# EAGLE design Audioaktor (EAGLE 5.02)
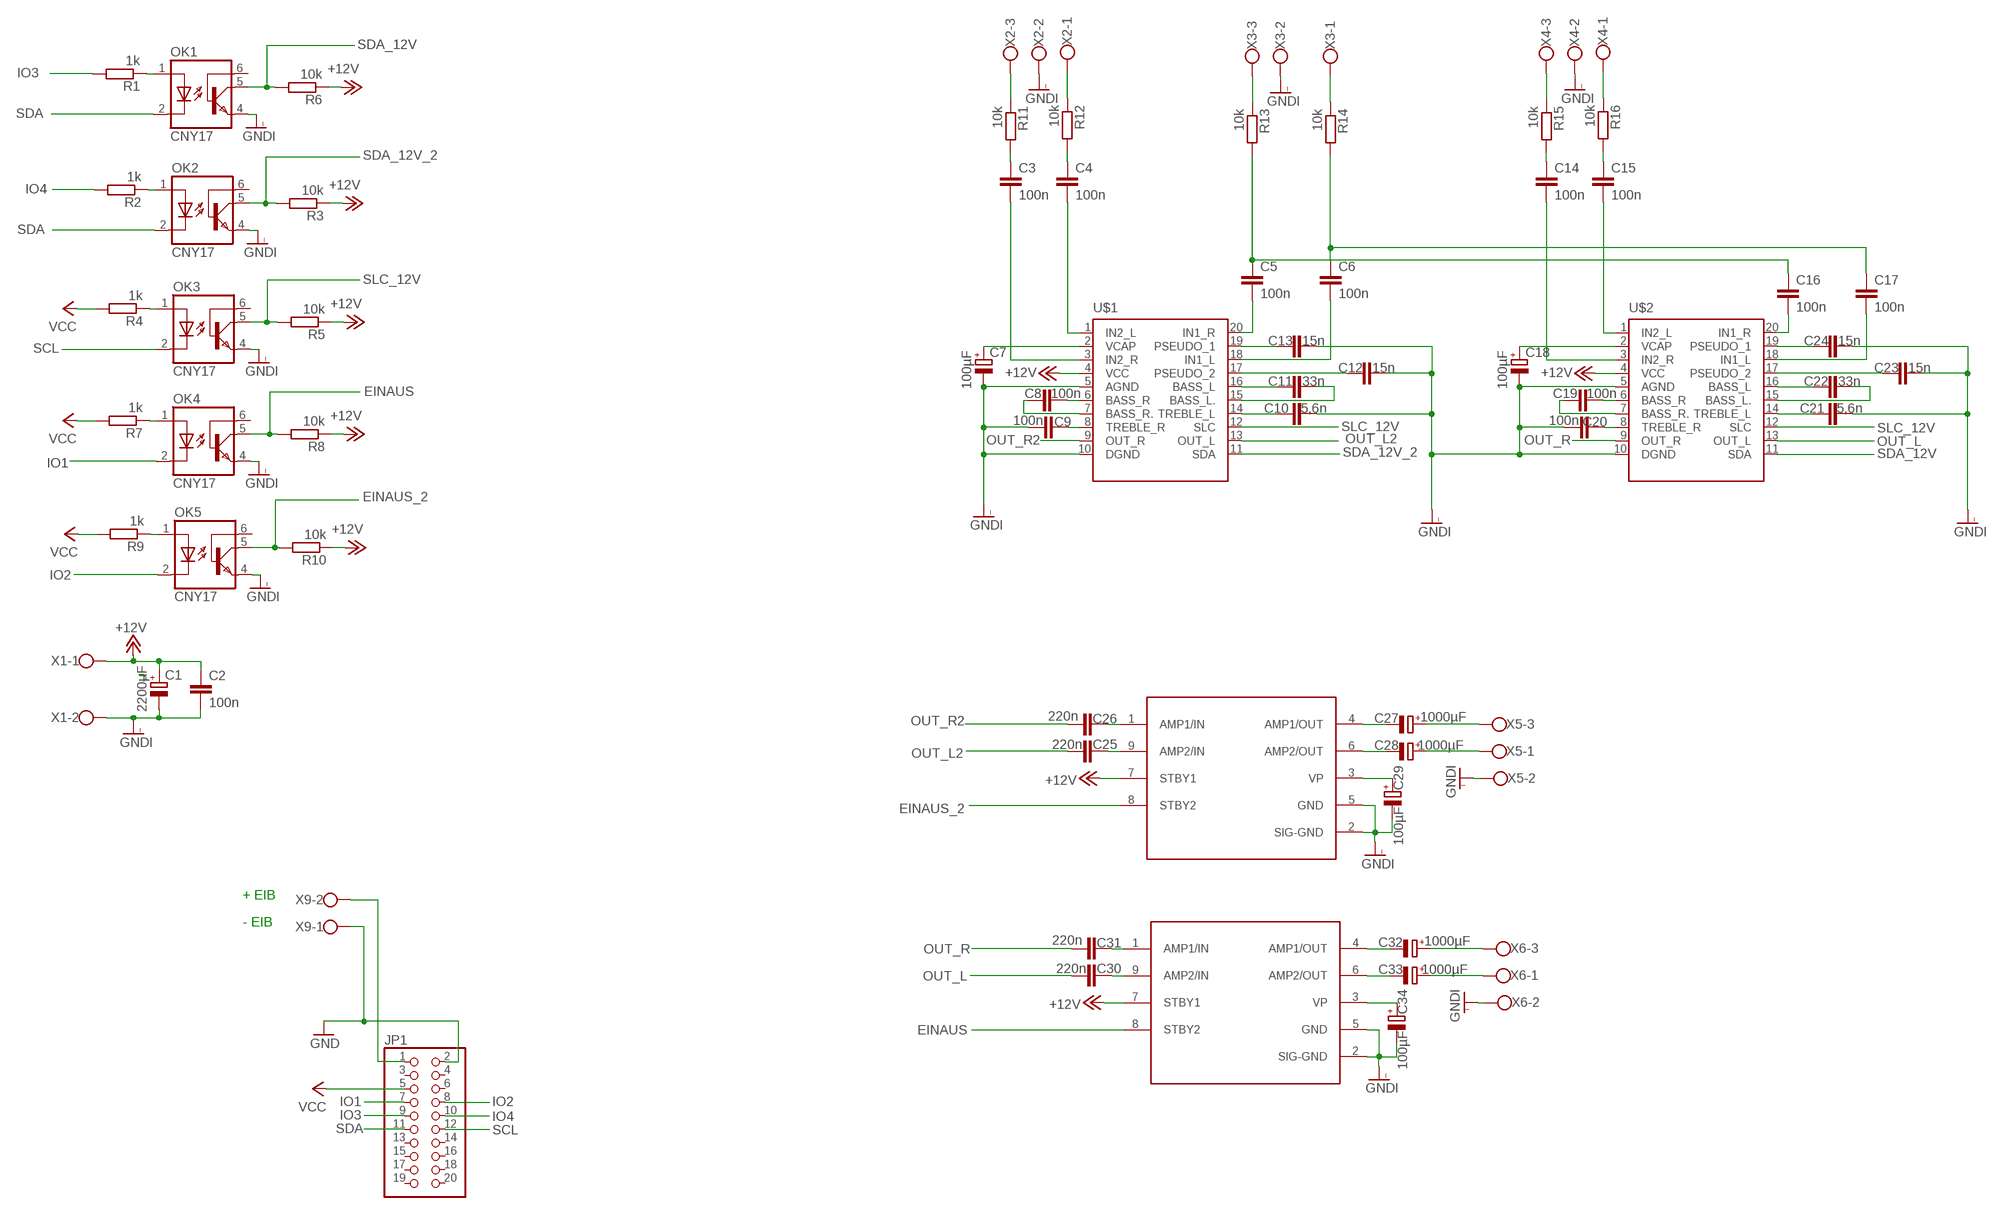
[diagram p0: schematic, sheet 1]

## Parts
C1  2200µF  CPOL-EUE5-10.5  [E5-10,5]
C2  100n  C-EU050-030X075  [C050-030X075]
C3  100n  C-EU050-030X075  [C050-030X075]
C4  100n  C-EU050-030X075  [C050-030X075]
C5  100n  C-EU050-030X075  [C050-030X075]
C6  100n  C-EU050-030X075  [C050-030X075]
C7  100µF  CPOL-EUE5-10.5  [E5-10,5]
C8  100n  C-EU050-030X075  [C050-030X075]
C9  100n  C-EU050-030X075  [C050-030X075]
C10  5,6n  C-EU050-030X075  [C050-030X075]
C11  33n  C-EU050-030X075  [C050-030X075]
C12  15n  C-EU050-030X075  [C050-030X075]
C13  15n  C-EU050-030X075  [C050-030X075]
C14  100n  C-EU050-030X075  [C050-030X075]
C15  100n  C-EU050-030X075  [C050-030X075]
C16  100n  C-EU050-030X075  [C050-030X075]
C17  100n  C-EU050-030X075  [C050-030X075]
C18  100µF  CPOL-EUE5-10.5  [E5-10,5]
C19  100n  C-EU050-030X075  [C050-030X075]
C20  100n  C-EU050-030X075  [C050-030X075]
C21  5,6n  C-EU050-030X075  [C050-030X075]
C22  33n  C-EU050-030X075  [C050-030X075]
C23  15n  C-EU050-030X075  [C050-030X075]
C24  15n  C-EU050-030X075  [C050-030X075]
C25  220n  C-EU050-030X075  [C050-030X075]
C26  220n  C-EU050-030X075  [C050-030X075]
C27  1000µF  CPOL-EUE5-10.5  [E5-10,5]
C28  1000µF  CPOL-EUE5-10.5  [E5-10,5]
C29  100µF  CPOL-EUE5-10.5  [E5-10,5]
C30  220n  C-EU050-030X075  [C050-030X075]
C31  220n  C-EU050-030X075  [C050-030X075]
C32  1000µF  CPOL-EUE5-10.5  [E5-10,5]
C33  1000µF  CPOL-EUE5-10.5  [E5-10,5]
C34  100µF  CPOL-EUE5-10.5  [E5-10,5]
JP1  PINHD-2X10  [2X10]
OK1  CNY17  [DIL06]
OK2  CNY17  [DIL06]
OK3  CNY17  [DIL06]
OK4  CNY17  [DIL06]
OK5  CNY17  [DIL06]
R1  1k  R-EU_0204/7  [0204/7]
R2  1k  R-EU_0204/7  [0204/7]
R3  10k  R-EU_0204/7  [0204/7]
R4  1k  R-EU_0204/7  [0204/7]
R5  10k  R-EU_0204/7  [0204/7]
R6  10k  R-EU_0204/7  [0204/7]
R7  1k  R-EU_0204/7  [0204/7]
R8  10k  R-EU_0204/7  [0204/7]
R9  1k  R-EU_0204/7  [0204/7]
R10  10k  R-EU_0204/7  [0204/7]
R11  10k  R-EU_0204/7  [0204/7]
R12  10k  R-EU_0204/7  [0204/7]
R13  10k  R-EU_0204/7  [0204/7]
R14  10k  R-EU_0204/7  [0204/7]
R15  10k  R-EU_0204/7  [0204/7]
R16  10k  R-EU_0204/7  [0204/7]
U$1  TDA8425  [DIL20]
U$2  TDA8425  [DIL20]
U$3  TDA1517  [TDA1517]
U$4  TDA1517  [TDA1517]
X1  W237-102  [W237-102]
X2  W237-103  [W237-103]
X3  W237-103  [W237-103]
X4  W237-103  [W237-103]
X5  W237-103  [W237-103]
X6  W237-103  [W237-103]
X9  W237-102  [W237-102]

## Nets
+12V: C1.+ C2.1 R3.1 R5.1 R6.1 R8.1 R10.1 U$1.4(VCC) U$2.4(VCC) U$3.7(STBY1) U$4.7(STBY1) X1.1
EINAUS: OK4.5(COL) R8.2 U$4.8(STBY2)
EINAUS_2: OK5.5(COL) R10.2 U$3.8(STBY2)
GND: JP1.2 X9.1
GNDI: C1.- C2.2 C7.- C9.1 C10.2 C12.2 C13.2 C18.- C20.1 C21.2 C23.2 C24.2 C29.- C34.- OK1.4(EMI) OK2.4(EMI) OK3.4(EMI) OK4.4(EMI) OK5.4(EMI) U$1.5(AGND) U$1.10(DGND) U$2.5(AGND) U$2.10(DGND) U$3.2(SIG-GND) U$3.5(GND) U$4.2(SIG-GND) U$4.5(GND) X1.2 X2.2 X3.2 X4.2 X5.2 X6.2
IO1: JP1.7 OK4.2(C)
IO2: JP1.8 OK5.2(C)
IO3: JP1.9 R1.2
IO4: JP1.10 R2.2
N$1: OK1.1(A) R1.1
N$2: OK2.1(A) R2.1
N$3: OK3.1(A) R4.1
N$4: OK4.1(A) R7.1
N$5: OK5.1(A) R9.1
N$6: R11.1 X2.3
N$7: R12.1 X2.1
N$8: C3.1 R11.2
N$9: C4.1 R12.2
N$10: R13.1 X3.3
N$11: R14.1 X3.1
N$12: C5.1 C16.1 R13.2
N$13: C6.1 C17.1 R14.2
N$14: C3.2 U$1.3(IN2_R)
N$15: C4.2 U$1.1(IN2_L)
N$17: C7.+ U$1.2(VCAP)
N$18: C8.2 U$1.6(BASS_R)
N$19: C8.1 U$1.7(BASS_R.)
N$20: JP1.1 X9.2
N$21: C9.2 U$1.8(TREBLE_R)
N$22: C10.1 U$1.14(TREBLE_L)
N$23: C11.1 U$1.16(BASS_L)
N$24: C11.2 U$1.15(BASS_L.)
N$25: C13.1 U$1.19(PSEUDO_1)
N$27: C12.1 U$1.17(PSEUDO_2)
N$28: C5.2 U$1.20(IN1_R)
N$29: C6.2 U$1.18(IN1_L)
N$30: R15.1 X4.3
N$31: R16.1 X4.1
N$32: C14.1 R15.2
N$33: C15.1 R16.2
N$34: C26.2 U$3.1(AMP1/IN)
N$36: C25.2 U$3.9(AMP2/IN)
N$37: C27.- U$3.4(AMP1/OUT)
N$38: C28.- U$3.6(AMP2/OUT)
N$39: C14.2 U$2.3(IN2_R)
N$40: C15.2 U$2.1(IN2_L)
N$41: C18.+ U$2.2(VCAP)
N$42: C19.2 U$2.6(BASS_R)
N$43: C19.1 U$2.7(BASS_R.)
N$44: C20.2 U$2.8(TREBLE_R)
N$45: C21.1 U$2.14(TREBLE_L)
N$46: C22.1 U$2.16(BASS_L)
N$47: C22.2 U$2.15(BASS_L.)
N$48: C23.1 U$2.17(PSEUDO_2)
N$49: C24.1 U$2.19(PSEUDO_1)
N$50: C16.2 U$2.20(IN1_R)
N$51: C17.2 U$2.18(IN1_L)
N$52: C29.+ U$3.3(VP)
N$53: C31.2 U$4.1(AMP1/IN)
N$54: C27.+ X5.3
N$55: C28.+ X5.1
N$56: C30.2 U$4.9(AMP2/IN)
N$57: C32.- U$4.4(AMP1/OUT)
N$58: C33.- U$4.6(AMP2/OUT)
N$59: C34.+ U$4.3(VP)
N$60: C32.+ X6.3
N$61: C33.+ X6.1
OUT_L: C30.1 U$2.13(OUT_L)
OUT_L2: C25.1 U$1.13(OUT_L)
OUT_R: C31.1 U$2.9(OUT_R)
OUT_R2: C26.1 U$1.9(OUT_R)
SCL: JP1.12 OK3.2(C)
SDA: JP1.11 OK1.2(C) OK2.2(C)
SDA_12V: OK1.5(COL) R6.2 U$2.11(SDA)
SDA_12V_2: OK2.5(COL) R3.2 U$1.11(SDA)
SLC_12V: OK3.5(COL) R5.2 U$1.12(SLC) U$2.12(SLC)
VCC: JP1.5 R4.2 R7.2 R9.2
Unconnected: JP1.3 JP1.4 JP1.6 JP1.13 JP1.14 JP1.15 JP1.16 JP1.17 JP1.18 JP1.19 JP1.20 OK1.6(BAS) OK2.6(BAS) OK3.6(BAS) OK4.6(BAS) OK5.6(BAS)

## Notes on the sheet
- + EIB
- - EIB

## Library data of the parts
C1 C7 C18 C27-C29 C32-C34 = rcl:CPOL-EU: POLARIZED CAPACITOR, European symbol
C2-C6 C8-C17 C19-C26 C30 C31 = rcl:C-EU: CAPACITOR, European symbol
JP1 = pinhead:PINHD-2X10: PIN HEADER
OK1-OK5 = optocoupler:CNY17: SIEMENS OPTO COUPLER
R1-R16 = rcl:R-EU_: RESISTOR, European symbol
U$1 U$2 = TDA:TDA8425
U$3 U$4 = TDA:TDA1517
X1 X9 = con-wago-500:W237-102: WAGO SCREW CLAMP
X2-X6 = con-wago-500:W237-103: WAGO SCREW CLAMP

## Board
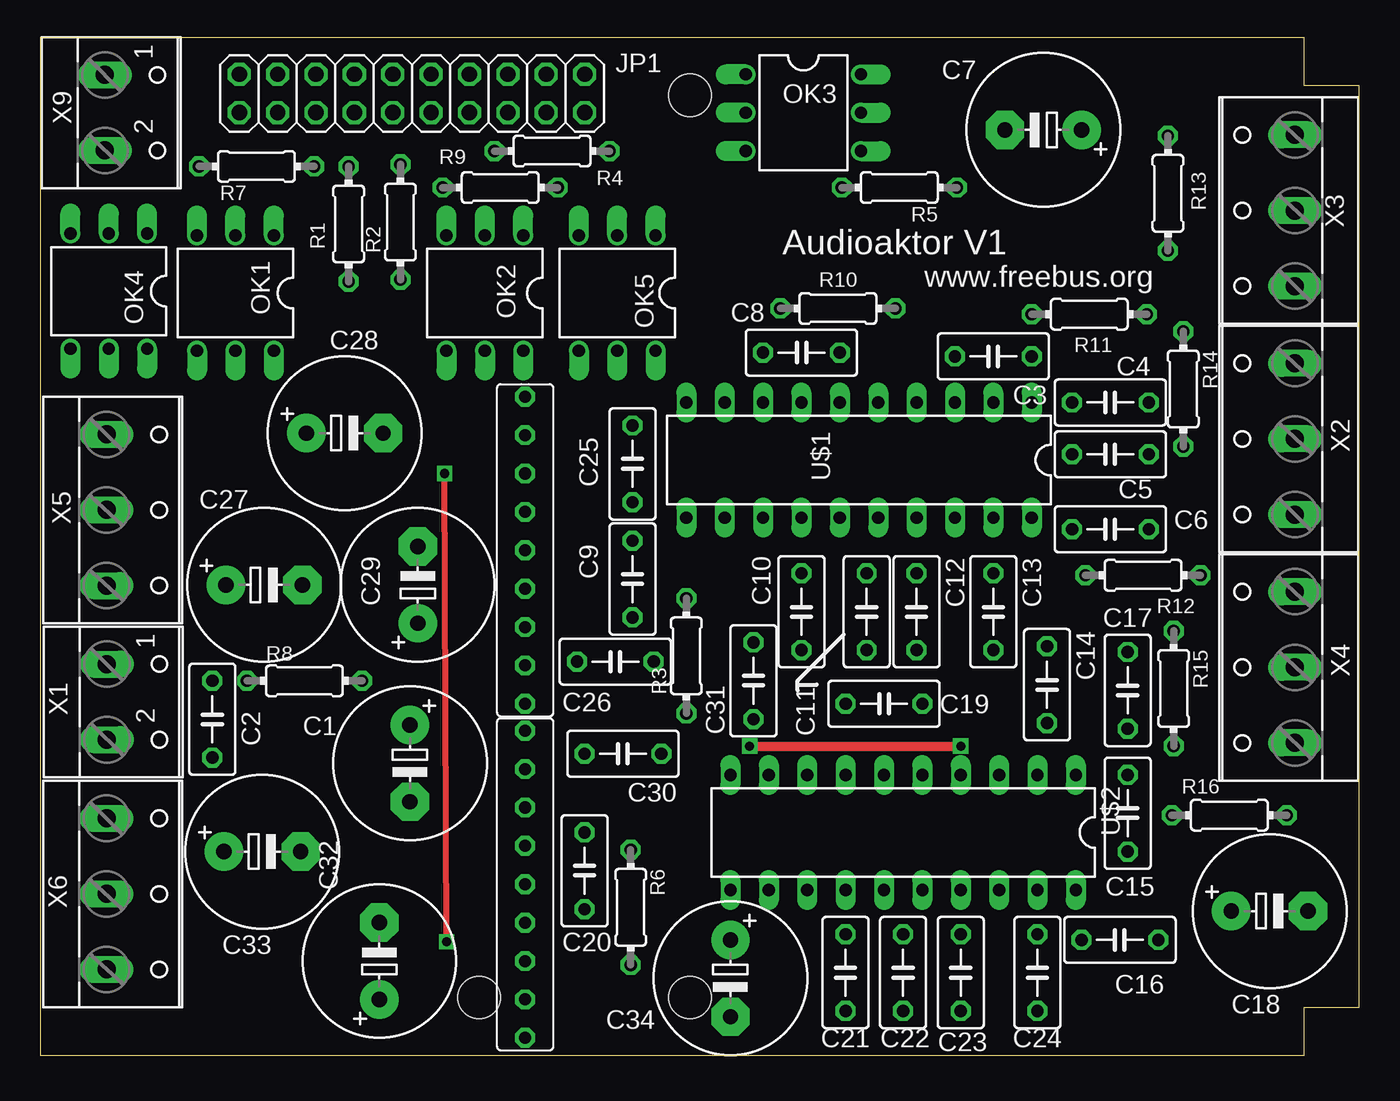
[diagram p1: board, top side]
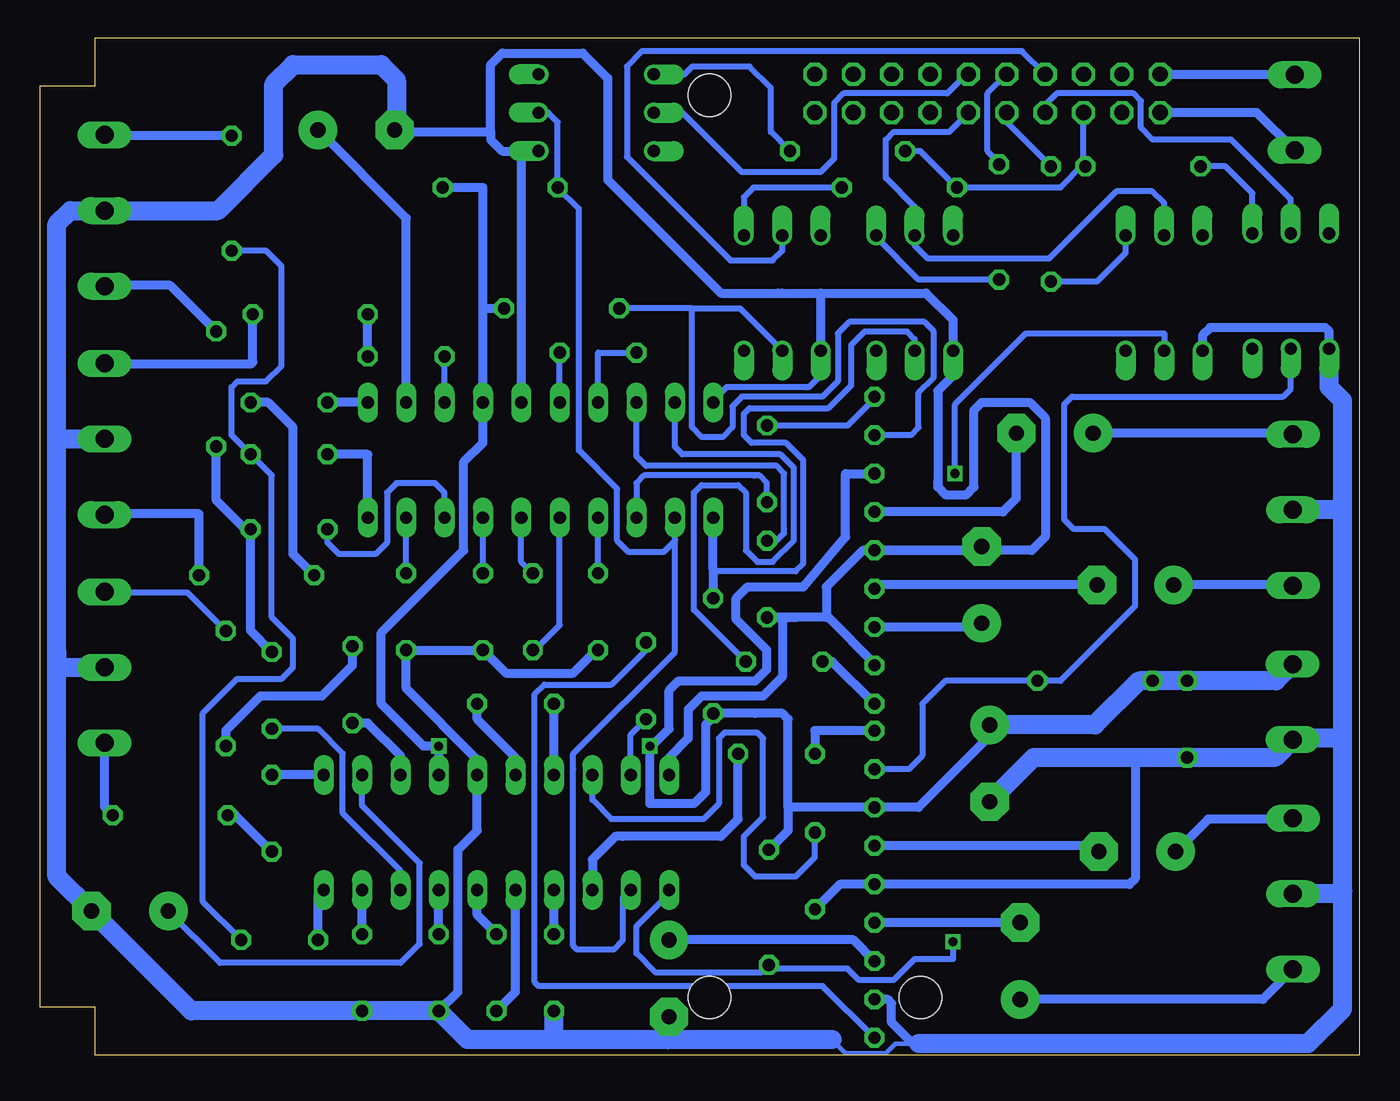
[diagram p2: board, bottom side, seen from below]

Size 87.3 x 67.31 mm. Coordinates in mm from the lower left corner, seen from the top.
Outline: 0,0.01 83.66,0 83.66,3.18 87.3,3.18 87.3,64.13 83.66,64.13 83.66,67.31 0,67.31 0,0.01
Copper layers (1*16): Top 0.035mm / dielectric 1.5mm / Bottom 0.035mm
Design rules "default *": minimum track width 10mil, minimum drill 24mil, track to track 16mil, track to pad 16mil, pad to pad 16mil, via to via 16mil, smd to smd 8mil, copper to edge 20mil, drill to drill 10mil, minimum pad ring 10mil, minimum via ring 8mil, stop-mask expansion 4mil, vias tented up to drill 0mil, thermal gap 10mil
Holes 2.8 mm at 43.02,3.81 43.02,63.5 29.04,3.81

### Footprints (pad centres in the part's own frame; a part is rotated, then mirrored left to right if it is on the bottom)
E5-10,5 = drill 1.016 pad 2.54 round: + -2.54,0 | drill 1.016 pad 2.54 octagon: - 2.54,0
C050-030X075 = drill 0.813 octagon: 1 -2.54,0; 2 2.54,0
2X10 = drill 1.016 octagon: 1 -11.43,-1.27; 2 -11.43,1.27; 3 -8.89,-1.27; 4 -8.89,1.27; 5 -6.35,-1.27; 6 -6.35,1.27; 7 -3.81,-1.27; 8 -3.81,1.27; 9 -1.27,-1.27; 10 -1.27,1.27; 11 1.27,-1.27; 12 1.27,1.27; 13 3.81,-1.27; 14 3.81,1.27; 15 6.35,-1.27; 16 6.35,1.27; 17 8.89,-1.27; 18 8.89,1.27; 19 11.43,-1.27; 20 11.43,1.27
DIL06 = drill 0.813 offset: 1 -2.54,-3.81; 2 0,-3.81; 3 2.54,-3.81; 4 2.54,3.81; 5 0,3.81; 6 -2.54,3.81
0204/7 = drill 0.813 octagon: 1 -3.81,0; 2 3.81,0
DIL20 = drill 0.813 long: 1 -10.16,-3.81; 2 -7.62,-3.81; 3 -5.08,-3.81; 4 -2.54,-3.81; 5 0,-3.81; 6 2.54,-3.81; 7 5.08,-3.81; 8 7.62,-3.81; 9 10.16,-3.81; 10 12.7,-3.81; 11 12.7,3.81; 12 10.16,3.81; 13 7.62,3.81; 14 5.08,3.81; 15 2.54,3.81; 16 0,3.81; 17 -2.54,3.81; 18 -5.08,3.81; 19 -7.62,3.81; 20 -10.16,3.81
TDA1517 = drill 0.8 octagon: 1 -10.16,0; 2 -7.62,0; 3 -5.08,0; 4 -2.54,0; 5 0,0; 6 2.54,0; 7 5.08,0; 8 7.62,0; 9 10.16,0
W237-102 = drill 1.194 long: 1 -2.5,-1.27; 2 2.5,-1.27
W237-103 = drill 1.194 long: 1 -5,-1.29; 2 0,-1.29; 3 5,-1.29

### Placement (x,y rotation side)
C1  24.47,19.3 270 top
C2  11.39,22.23 270 top
C3  63.08,46.23 180 top
C4  70.83,43.18 180 top
C5  70.83,39.75 180 top
C6  70.83,34.8 180 top
C7  66.38,61.21 180 top
C8  50.38,46.48 0 top
C9  39.2,31.5 90 top
C10  50.38,29.34 270 top
C11  54.7,29.34 270 top
C12  58,29.34 270 top
C13  63.08,29.34 270 top
C14  66.64,24.51 270 top
C15  71.97,16 90 top
C16  71.46,7.62 180 top
C17  71.97,24.13 270 top
C18  81.37,9.53 0 top
C19  55.84,23.24 0 top
C20  36.03,12.19 90 top
C21  53.3,5.46 270 top
C22  57.11,5.46 270 top
C23  60.92,5.46 270 top
C24  66,5.46 270 top
C25  39.2,39.12 90 top
C26  38.06,26.04 180 top
C27  14.82,31.12 0 top
C28  20.15,41.15 0 top
C29  24.98,31.12 90 top
C30  38.57,19.94 180 top
C31  47.21,24.77 90 top
C32  22.44,6.22 90 top
C33  14.69,13.46 0 top
C34  45.68,5.08 270 top
JP1  24.6,63.63 0 top
OK1  12.92,50.42 180 top
OK2  29.43,50.42 180 top
OK3  50.51,62.36 270 top
OK4  4.53,50.55 180 top
OK5  38.19,50.42 180 top
R1  20.41,54.99 90 top
R2  23.84,55.12 90 top
R3  42.76,26.42 90 top
R4  33.87,59.82 180 top
R5  56.86,57.4 180 top
R6  39.08,9.78 270 top
R7  14.31,58.8 0 top
R8  17.49,24.77 0 top
R9  30.44,57.4 180 top
R10  52.79,49.4 180 top
R11  69.43,49.02 180 top
R12  72.99,31.75 180 top
R13  74.64,57.02 270 top
R14  75.65,44.07 270 top
R15  75.02,24.26 270 top
R16  78.7,15.88 180 top
U$1  55.46,39.37 180 top
U$2  58.38,14.73 180 top
U$3  32.09,33.4 90 top
U$4  32.09,11.3 90 top
X1  5.68,23.37 270 top
X2  81.75,40.77 90 top
X3  81.75,55.88 90 top
X4  81.75,25.65 90 top
X5  5.68,36.07 270 top
X6  5.68,10.67 270 top
X9  5.55,62.36 270 top

### Tracks (layer width: path | path; a pad name or v marks a point on that pad's centre or on a via)
+12V  (via drill 0.6)
  Top 0.61: v46.95,20.45 v60.92,20.45
  Bottom 0.61: R5.1 58,57.4 58,49.4 | 58,49.4 U$1.4 58,40.51 59.27,39.24 59.27,33.4 64.73,27.94 64.73,23.24 61.94,20.45 v60.92,20.45 | 58,49.4 R10.1 | 60.92,18.92 60.92,19.69 | U$3.7 34,38.48 34,34.29 36.79,30.99 40.48,30.99 41.24,30.23 41.24,28.83 39.2,26.8 39.2,25.53 39.97,24.77 45.05,24.77 45.68,24.13 45.68,21.59 46.95,20.32 | 60.92,18.92 U$2.4 | v60.92,20.45 60.92,18.92 | v60.92,20.45 60.8,20.45 | 39.97,22.61 R3.1 | R6.1 37.81,14.86 37.81,16.38 | 37.81,16.38 37.81,22.23 38.19,22.61 39.97,22.61 | 39.97,22.61 42.51,22.61 43.27,21.84 43.27,17.4 44.03,16.64 46.95,16.64 46.95,20.32 | 46.95,20.32 v46.95,20.45 | 37.81,16.38 U$4.7 29.17,16.38 24.6,20.96 24.6,21.84 C1.+
  Bottom 1.27: X1.1 5.51,24.77 C2.1 13.55,24.77 | C1.+ 17.49,21.84 14.57,24.77 13.55,24.77 | 13.55,24.77 R8.1
EINAUS
  Bottom 0.406: OK4.5 4.53,44.07 5.04,43.56 19.01,43.56 19.52,43.05 19.52,35.43 18.88,34.8 16.85,34.8 14.82,32.77 14.82,29.72 19.77,24.77 R8.2 27.39,24.77 28.92,23.24 28.92,19.81 29.81,18.92 U$4.8
EINAUS_2
  Bottom 0.406: OK5.5 40.98,49.4 44.16,49.4 | 44.16,49.4 R10.2 | 44.16,49.4 44.16,41.53 43.52,40.89 42.13,40.89 41.49,41.53 41.49,42.93 40.86,43.56 35.52,43.56 34.51,44.58 34.51,47.75 33.74,48.51 28.79,48.51 28.16,47.88 28.16,44.83 29.17,43.81 29.17,41.53 29.68,41.02 U$3.8
GND
  Bottom 0.61: X9.1 13.17,64.86 JP1.2
GNDI
  Bottom 0.305: U$4.2 31.97,3.68 | 34.89,1.02 34,0.13 31.33,0.13 30.7,0.76 29.3,0.76
  Bottom 0.406: 36.66,44.2 36.54,44.2 | 36.66,44.2 41.87,44.2 42.76,43.31 U$1.10 42.76,43.05 | OK5.4 35.65,44.96 36.41,44.2 36.66,44.2
  Bottom 0.61: 38.44,50.42 38.19,50.42 | 38.44,50.42 42.25,50.42 49.75,57.91 49.75,64.64 51.4,66.29 56.73,66.29 57.49,65.53 57.49,61.09 | 57.49,61.09 57.49,60.58 56.73,59.82 55.46,59.82 | 55.46,59.82 OK3.4 | 55.46,59.82 U$1.5 | C7.- 63.72,61.09 57.49,61.09 | 37.81,28.96 37.3,28.96 | 37.81,28.96 38.06,28.96 | 38.06,28.96 C9.1 | 35.27,28.96 35.14,28.96 32.09,25.91 U$3.2 | 35.27,28.96 37.81,28.96 | 35.27,28.96 35.27,30.99 32.85,33.4 | C23.2 59.65,4.19 59.65,13.59 58.38,14.86 U$2.5 58.38,19.56 63.08,24.26 C13.2 C12.2 56.48,25.27 52.03,25.27 50.51,26.8 C10.2 50.38,26.92 | C29.- 25.23,33.4 U$3.5 32.85,33.4 | U$2.10 45.68,19.69 44.41,20.96 44.41,22.86 43.52,23.75 39.46,23.75 38.19,25.02 38.19,28.7 38.06,28.83 38.06,28.96 | U$4.5 31.97,11.3 | C20.1 34.38,11.3 U$4.5 | OK4.4 1.99,47.88 2.25,48.13 9.87,48.13 10.38,47.62 OK1.4 | 32.85,33.4 21.68,33.4 20.79,34.29 20.79,42.16 21.81,43.18 24.98,43.18 25.49,42.67 25.49,37.59 26,37.08 27.39,37.08 27.9,37.59 27.9,37.97 | U$4.2 31.2,3.68 30.95,3.43 30.95,2.16 29.55,0.76 29.3,0.76 29.17,0.76 | 26.89,44.96 OK2.4 | 27.9,37.97 27.9,37.85 | 27.9,37.97 27.9,43.94 26.89,44.96 | U$4.5 15.2,11.3 14.82,11.68 14.82,19.69 | 26.89,44.96 26.89,48.64 28.66,50.42 35.65,50.42 | 38.44,50.42 35.65,50.42 | 35.65,50.42 OK5.4
  Bottom 1.27: 86.19,40.77 86.19,54.99 85.31,55.88 X3.2 75.53,55.88 71.84,59.56 71.84,64.26 70.57,65.53 64.73,65.53 63.72,64.52 63.72,61.21 C7.- | 86.19,26.67 86.19,40.77 | 86.19,26.67 86.19,26.16 | 82.89,25.65 X4.2 86.19,25.65 | 86.19,40.77 X2.2 | 53.3,1.02 59.02,1.02 C23.2 C24.2 77.3,2.92 C18.- 86.19,11.81 86.19,25.65 | 53.3,1.02 C21.2 | 45.81,1.02 45.68,1.02 C34.- | 45.81,1.02 53.3,1.02 | 34.89,1.02 45.81,1.02 | 5.59,19.69 X1.2 | 5.59,19.69 C2.2 14.82,19.69 21.55,19.69 C1.- | X6.2 1.23,10.67 1.1,10.79 1.1,10.92 | 1.1,10.92 1.1,20.96 | 1.1,20.96 1.1,36.07 | 1.1,36.07 1.1,43.31 1.99,44.2 OK4.4 | 1.1,36.07 X5.2 | 5.59,19.69 4.32,20.96 1.1,20.96 | 1.1,10.92 1.1,3.05 3.39,0.76 29.17,0.76 | 86.19,25.65 86.19,26.67
IO1
  Bottom 0.406: 4.53,54.23 OK4.2 4.53,56.64 8.47,60.58 13.68,60.58 14.44,61.34 14.44,63.12 14.95,63.63 20.03,63.63 20.79,62.86 JP1.7
IO2
  Bottom 0.406: JP1.8 22.31,66.42 47.46,66.42 48.48,65.41 48.48,59.44 41.62,52.58 38.82,52.58 38.19,53.21 OK5.2
IO3
  Bottom 0.406: R1.2 23.33,61.72 JP1.9
IO4
  Bottom 0.406: JP1.10 24.6,63.63 24.6,59.82 23.84,59.05 R2.2 23.84,58.8
N$1
  Bottom 0.406: R1.1 17.36,51.18 15.46,53.09 OK1.1
N$2
  Bottom 0.406: R2.1 29.17,51.31 31.97,54.1 OK2.1
N$3
  Bottom 0.406: R4.1 38.95,61.09 38.95,64.01 40.35,65.41 44.16,65.41 44.67,64.9 OK3.1 46.82,64.9
N$4
  Bottom 0.406: R7.1 8.85,58.8 7.07,57.02 OK4.1
N$5
  Bottom 0.406: R9.1 40.09,57.4 40.73,56.77 OK5.1
N$6
  Bottom 0.61: R11.1 73.24,45.85 73.37,45.72 83.02,45.72 83.02,45.75 X2.3
N$7
  Bottom 0.61: 83.09,35.81 83.15,35.81 | 83.09,35.81 X2.1 | R12.1 76.8,35.81 83.09,35.81
N$8
  Bottom 0.61: C3.1 R11.2
N$9
  Bottom 0.61: R12.2 70.57,33.15 70.57,35.31 70.57,41.53 72.22,43.18 C4.1
N$10
  Bottom 0.61: X3.3 83.02,60.86 83.02,60.83 R13.1
N$11
  Bottom 0.61: X3.1 82.99,50.93 78.7,50.93 R14.1
N$12
  Bottom 0.406: R13.2 72.35,53.21 71.34,52.2 71.34,45.59 72.35,44.58 74.26,44.58 74.64,44.2 74.64,41.02 C5.1 71.97,38.35 71.97,28.96 70.57,27.56 70.57,25.65 71.34,24.89 74.26,24.89 76.54,22.61 76.54,10.16 C16.1
N$13
  Bottom 0.61: R14.2 75.65,36.7 73.75,34.8 C6.1 | C6.1 73.24,34.8 | C17.1 73.37,28.07 C6.1
N$14
  Bottom 0.406: U$1.3 C3.2
N$15
  Bottom 0.61: U$1.1 C4.2
N$17
  Bottom 0.61: C7.+ 63.08,55.37 U$1.2
N$18
  Bottom 0.406: 52.92,43.05 U$1.6 C8.2
N$19
  Bottom 0.406: C8.1 50.38,46.48 U$1.7
N$20
  Bottom 0.61: X9.2 6.78,62.36 JP1.1
N$21
  Bottom 0.406: C9.2 38.57,34.04 38.06,34.54 38.06,34.8 38.06,38.48 38.57,38.99 47.21,38.99 47.84,39.62 U$1.8
N$22
  Bottom 0.406: C10.1 U$1.14
N$23
  Bottom 0.406: 55.46,35.69 U$1.16 55.46,32.64 C11.1
N$24
  Bottom 0.406: U$1.15 52.92,28.45 54.57,26.8 C11.2
N$25
  Bottom 0.406: C13.1 U$1.19
N$27
  Bottom 0.406: C12.1 U$1.17
N$28
  Bottom 0.61: U$1.20 65.62,39.75 C5.2
N$29
  Bottom 0.406: U$1.18 60.54,37.21 61.18,37.85 63.72,37.85 64.35,37.21 64.35,33.91 65.11,33.15 67.53,33.15 68.29,33.91 C6.2 68.29,34.92
N$30
  Bottom 0.406: 83.09,30.61 83.15,30.61 | 83.09,30.61 X4.3 | R15.1 77.56,30.61 83.09,30.61
N$31
  Bottom 0.61: 83.02,20.67 83.02,20.7 | 83.02,20.67 X4.1 | R16.1 83.02,16.38 83.02,20.67
N$32
  Bottom 0.61: R15.2 75.02,21.46 72.73,23.75 68.67,23.75 66.64,25.78 C14.1
N$33
  Bottom 0.61: C15.1 74.38,15.88 R16.2
N$34
  Bottom 0.61: 35.65,26.04 C26.2 34.89,26.04 U$3.1
N$36
  Bottom 0.406: C25.2 33.87,41.66 32.09,43.43 U$3.9
N$37
  Bottom 0.61: C27.- 31.84,31.12 arc-90 U$3.4
N$38
  Bottom 0.61: U$3.6 23.58,35.94 22.7,36.83 C28.-
N$39
  Bottom 0.61: U$2.3 63.46,19.81 65.62,21.97 C14.2
N$40
  Bottom 0.61: U$2.1 C15.2
N$41
  Bottom 0.406: C18.+ 75.4,6.1 63.46,6.1 62.19,7.37 62.19,12.7 66,16.51 U$2.2
N$42
  Bottom 0.61: U$2.6 55.84,19.69 58.38,22.23 C19.2
N$43
  Bottom 0.61: U$2.7 C19.1
N$44
  Bottom 0.406: C20.2 36.03,13.08 37.3,11.81 39.84,11.81 39.97,11.81 40.73,12.57 40.73,14.48 39.46,15.75 39.46,20.96 39.84,21.34 42,21.34 42.38,20.96 42.38,16.64 43.4,15.62 49.49,15.62 50.76,16.89 U$2.8
N$45
  Bottom 0.61: C21.1 U$2.14
N$46
  Bottom 0.61: C22.1 58.38,9.27 U$2.16
N$47
  Bottom 0.61: U$2.15 55.84,4.19 C22.2
N$48
  Bottom 0.61: C23.1 U$2.17
N$49
  Bottom 0.61: C24.1 U$2.19
N$50
  Bottom 0.61: U$2.20 68.92,10.54 C16.2
N$51
  Bottom 0.406: U$2.18 63.46,12.19 67.27,16 67.27,19.94 68.92,21.59 C17.2
N$52
  Bottom 0.61: C29.+ 25.23,28.32 U$3.3
N$53
  Bottom 0.406: C31.2 47.21,26.8 49.49,24.51 53.94,24.51 54.57,23.88 54.57,4.83 54.32,4.57 35.52,4.57 U$4.1
N$54
  Bottom 0.61: 12.41,31.12 C27.+ 4.43,31.12 X5.3
N$55
  Bottom 0.61: X5.1 4.47,41.15 C28.+ 17.74,41.15
N$56
  Bottom 0.61: U$4.9 36.03,21.46 C30.2
N$57
  Bottom 0.61: C32.- U$4.4
N$58
  Bottom 0.61: 32.22,13.84 U$4.6 17.61,13.84 C33.-
N$59
  Bottom 0.61: U$4.3 33.49,7.62 C34.+
N$60
  Bottom 0.61: 22.57,3.68 C32.+ 6.37,3.68 X6.3
N$61
  Bottom 0.61: X6.1 4.41,15.65 4.41,15.62 10,15.62 C33.+
OUT_L
  Bottom 0.61: U$2.13 50.76,12.95 49.24,14.48 48.73,14.48 42.25,14.48 41.11,15.62 C30.1
OUT_L2
  Bottom 0.406: U$1.13 47.84,37.85 47.33,38.35 40.09,38.35 | 40.09,38.35 39.97,38.35 | C25.1 39.2,37.85 39.71,38.35 40.09,38.35
OUT_R
  Bottom 0.406: U$2.9 48.22,21.21 C31.1
OUT_R2
  Bottom 0.406: U$1.9 45.3,40.26 44.79,39.75 38.32,39.75 37.43,38.86 37.43,34.04 38.82,32.64 39.84,32.64 40.6,33.4 40.6,37.21 41.11,37.72 43.52,37.72 44.03,37.21 44.03,29.46 C26.1
SCL
  Bottom 0.406: JP1.12 26,64.9 27.27,63.63 34.12,63.63 34.76,62.99 34.76,59.31 35.65,58.42 40.86,58.42 44.79,62.36 OK3.2
SDA
  Bottom 0.406: OK1.2 12.92,56.39 13.68,57.15 16.09,57.15 20.54,52.7 28.54,52.7 29.43,53.59 OK2.2 | JP1.11 27.14,61.09 30.82,61.09 31.33,60.58 31.33,58.04 29.43,56.13 OK2.2 | OK2.2 29.43,54.1
SDA_12V  (via drill 0.6)
  Top 0.406: v26.89,7.49 v26.76,38.48
  Bottom 0.406: U$2.11 45.68,10.67 47.84,8.51 47.84,6.73 46.57,5.46 39.59,5.46 R6.2 38.82,5.71 33.87,5.71 33.11,4.95 30.82,4.95 29.43,6.35 26.89,6.35 v26.89,7.49 | OK1.5 12.92,47.75 22.06,47.75 26.76,43.05 v26.76,38.48
SDA_12V_2
  Bottom 0.406: 42.76,32.13 42.63,32.13 42.51,32 37.3,32 36.79,32.51 36.79,39.37 37.94,40.51 40.22,40.51 40.73,41.02 40.73,42.42 40.35,42.8 35.14,42.8 33.62,44.32 33.62,46.99 32.73,47.88 29.93,47.88 29.43,47.37 OK2.5
  Bottom 0.61: R3.2 42.76,32.13 U$1.11
SLC_12V
  Bottom 0.406: OK3.5 53.68,62.36 53.05,61.72 R5.2 51.65,56.01 51.65,40 49.11,37.46 49.11,34.04 48.35,33.27 46.06,33.27 45.3,34.04 45.3,34.16 | 45.3,34.16 U$1.12 | U$2.12 48.73,10.41 48.73,7.62 49.37,6.98 51.78,6.98 52.03,7.24 52.03,18.92 52.03,19.94 45.3,26.67 45.3,34.16
VCC
  Bottom 0.406: R7.2 18.25,58.93 | 18.25,58.93 JP1.5 | 18.25,58.93 19.77,57.4 R9.2 29.04,59.82 R4.2

### Text on the board
tNames: Audioaktor V1 | www.freebus.org